# Altium project PCB_Project.PrjPcb
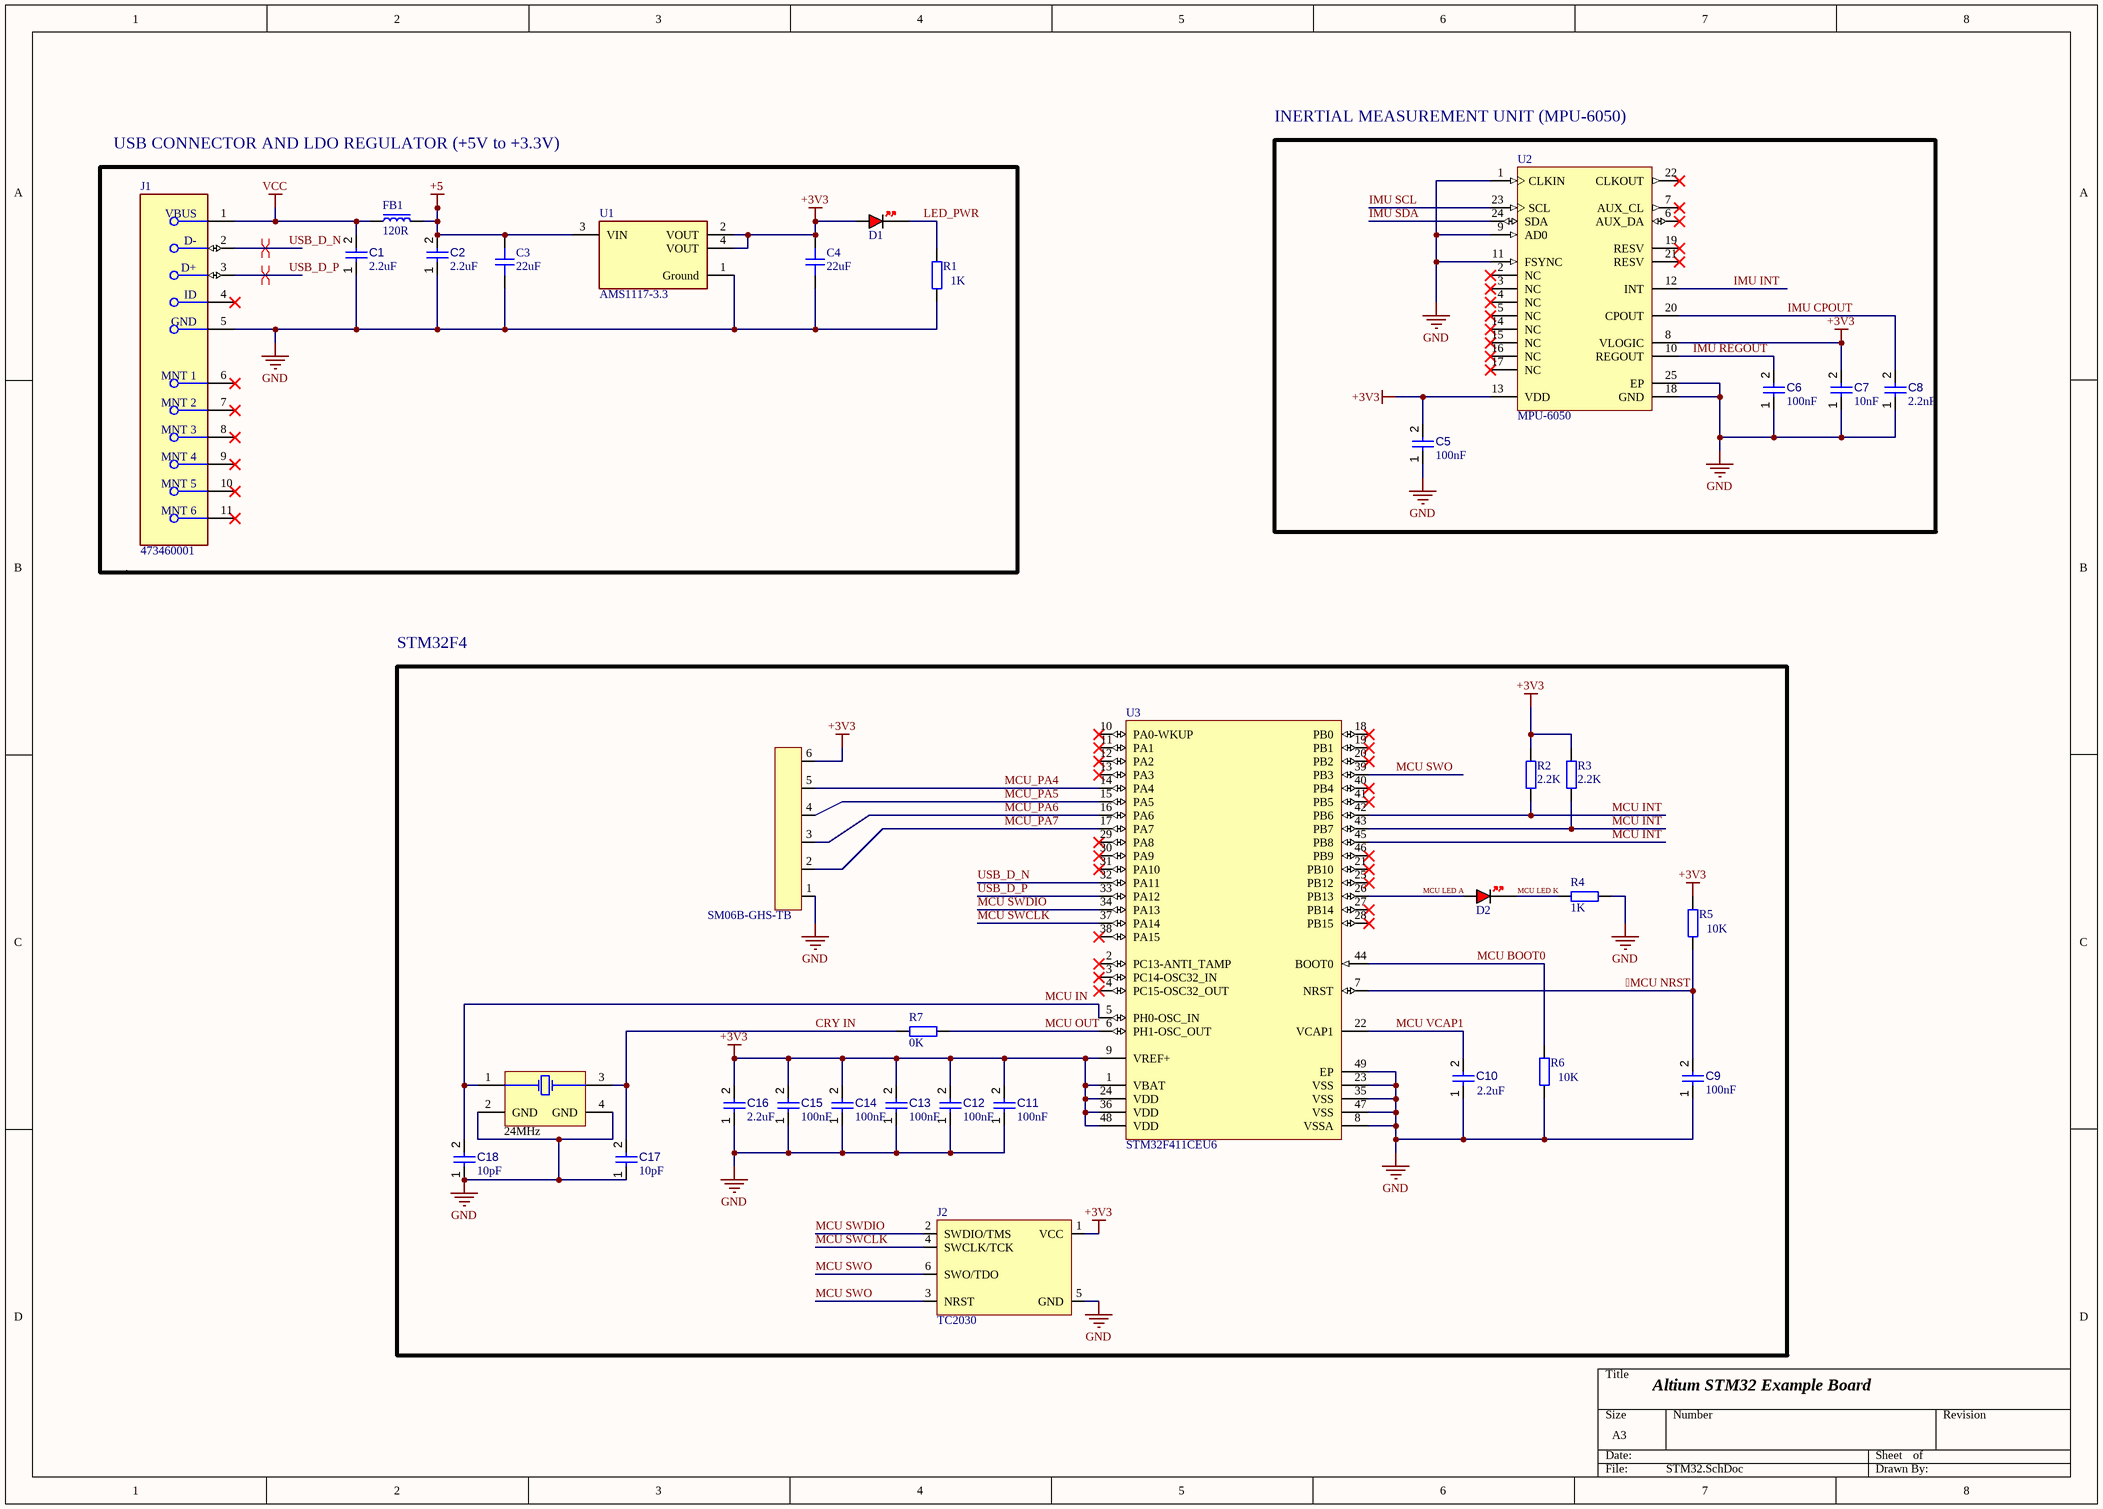
[diagram p0: STM32.SchDoc]
1 sheet, 35 parts. Net scope: global (net labels, ports and power ports of the same name join across sheets).
Board file: STM32.PcbDoc

## Sheet STM32.SchDoc
size A3; SheetNumber: 1; SheetTotal: 1

### Parts
C1  value 2.2uF  [CAPC0402(1005)60_L]  (hidden comment: Capacitor 100nF +/-20% 50V 0402)
C2  value 2.2uF  [CAPC0402(1005)60_L]  (hidden comment: Capacitor 100nF +/-20% 50V 0402)
C3  22uF  [CAP_0805]
C4  22uF  [CAP_0805]
C5  value 100nF  [CAPC0402(1005)60_L]  (hidden comment: Capacitor 100nF +/-20% 50V 0402)
C6  value 100nF  [CAPC0402(1005)60_L]  (hidden comment: Capacitor 100nF +/-20% 50V 0402)
C7  value 10nF  [CAPC0402(1005)60_L]  (hidden comment: Capacitor 100nF +/-20% 50V 0402)
C8  value 2.2nF  [CAPC0402(1005)60_L]  (hidden comment: Capacitor 100nF +/-20% 50V 0402)
C9  value 100nF  [CAPC0402(1005)60_L]  (hidden comment: Capacitor 100nF +/-20% 50V 0402)
C10  value 2.2uF  [CAPC0402(1005)60_L]  (hidden comment: Capacitor 100nF +/-20% 50V 0402)
C11  value 100nF  [CAPC0402(1005)60_L]  (hidden comment: Capacitor 100nF +/-20% 50V 0402)
C12  value 100nF  [CAPC0402(1005)60_L]  (hidden comment: Capacitor 100nF +/-20% 50V 0402)
C13  value 100nF  [CAPC0402(1005)60_L]  (hidden comment: Capacitor 100nF +/-20% 50V 0402)
C14  value 100nF  [CAPC0402(1005)60_L]  (hidden comment: Capacitor 100nF +/-20% 50V 0402)
C15  value 100nF  [CAPC0402(1005)60_L]  (hidden comment: Capacitor 100nF +/-20% 50V 0402)
C16  value 2.2uF  [CAPC0402(1005)60_L]  (hidden comment: Capacitor 100nF +/-20% 50V 0402)
C17  value 10pF  [CAPC0402(1005)60_L]  (hidden comment: Capacitor 100nF +/-20% 50V 0402)
C18  value 10pF  [CAPC0402(1005)60_L]  (hidden comment: Capacitor 100nF +/-20% 50V 0402)
D1  RED  [LED_0402_RED]  (value not drawn)
D2  RED  [LED_0402_RED]  (value not drawn)
FB1  120R  [FB_0402]
J1  473460001  [FP-473460001-MFG]
J2  TC2030  [TC2030-FP]  (no BOM)
R1  1K  [RES_0201]
R2  2.2K  [RES_0201]
R3  2.2K  [RES_0201]
R4  1K  [RES_0201]
R5  10K  [RES_0201]
R6  10K  [RES_0201]
R7  0K  [RES_0201]
U1  AMS1117-3.3  [FP-AMS1117-IPC_C]
U2  MPU-6050  [IS-QFN-24_V]
U3  STM32F411CEU6  [STM-UFQFPN48_L]
  24MHz  [ABRA-ABM3B-4_V]
  SM06B-GHS-TB  [SM06B-GHS-TB]

### Blocks framed on the sheet
USB CONNECTOR AND LDO REGULATOR (+5V to +3.3V): C1-C4 D1 FB1 J1 R1 U1
INERTIAL MEASUREMENT UNIT (MPU-6050): C5-C8 U2
STM32F4: C9-C18 D2 J2 R2-R7 U3 

### Nets
+3V3: C4.2 C5.2 C7.2 C11.2 C12.2 C13.2 C14.2 C15.2 C16.2 D1.A J2.1(VCC) R2.1 R3.1 R5.1 U1.2(VOUT) U1.4(VOUT) U2.8(VLOGIC) U2.13(VDD) U3.1(VBAT) U3.9(VREF+) U3.24(VDD) U3.36(VDD) U3.48(VDD) .6
+5: C2.2 C3.2 FB1.2 U1.3(VIN)
GND: C1.1 C2.1 C3.1 C4.1 C5.1 C6.1 C7.1 C8.1 C9.1 C10.1 C11.1 C12.1 C13.1 C14.1 C15.1 C16.1 C17.1 C18.1 J1.5(GND) J2.5(GND) R1.1 R4.1 R6.2 U1.1(Ground) U2.1(CLKIN) U2.9(AD0) U2.11(FSYNC) U2.18(GND) U2.25(EP) U3.8(VSSA) U3.23(VSS) U3.35(VSS) U3.47(VSS) U3.49(EP) .1 .2(GND) .4(GND)
VCC: C1.2 FB1.1 J1.1(VBUS)
MCU NRST: C9.2 R5.2 U3.7(NRST)
CRY IN: C17.2 R7.1 .3(X2)
IMU CPOUT: C8.2 U2.20(CPOUT)
IMU INT: U2.12(INT)
IMU REGOUT: C6.2 U2.10(REGOUT)
IMU SCL: U2.23(SCL)
IMU SDA: U2.24(SDA)
LED_PWR: D1.K R1.2
MCU BOOT0: R6.1 U3.44(BOOT0)
MCU IN: C18.2 U3.5(PH0-OSC_IN) .1(X1)
MCU INT: R2.2 R3.2 U3.42(PB6) U3.43(PB7) U3.45(PB8)
MCU LED A: D2.A U3.26(PB13)
MCU LED K: D2.K R4.2
MCU OUT: R7.2 U3.6(PH1-OSC_OUT)
MCU SWCLK: J2.4(SWCLK/TCK) U3.37(PA14)
MCU SWDIO: J2.2(SWDIO/TMS) U3.34(PA13)
MCU SWO: J2.3(NRST) J2.6(SWO/TDO) U3.39(PB3)
MCU VCAP1: C10.2 U3.22(VCAP1)
MCU_PA4: U3.14(PA4) .5
MCU_PA5: U3.15(PA5) .4
MCU_PA6: U3.16(PA6) .3
MCU_PA7: U3.17(PA7) .2
USB_D_N: J1.2(D-) U3.32(PA11)
USB_D_P: J1.3(D+) U3.33(PA12)

Not connected (* = marked no-connect by the designer): J1 4(ID)* 6(MNT_1)* 7(MNT_2)* 8(MNT_3)* 9(MNT_4)* 10(MNT_5)* 11(MNT_6)*; U2 2(NC)* 3(NC)* 4(NC)* 5(NC)* 6(AUX_DA)* 7(AUX_CL)* 14(NC)* 15(NC)* 16(NC)* 17(NC)* 19(RESV)* 21(RESV)* 22(CLKOUT)*; U3 2(PC13-ANTI_TAMP)* 3(PC14-OSC32_IN)* 4(PC15-OSC32_OUT)* 10(PA0-WKUP)* 11(PA1)* 12(PA2)* 13(PA3)* 18(PB0)* 19(PB1)* 20(PB2)* 21(PB10)* 25(PB12)* 27(PB14)* 28(PB15)* 29(PA8)* 30(PA9)* 31(PA10)* 38(PA15)* 40(PB4)* 41(PB5)* 46(PB9)*

### Layout directives
differential pair: USB_D_N, USB_D_P

### Notes on the sheet
- Altium STM32 Example Board

### Library data of the parts
C1 C2 C5-C18 = CMP-001-00067-3: Chip Capacitor, 100nF +/-20%, 50V, 0402, Thickness 0.6 mm; Tolerance: 10%; Min Operating Temperature: -55°C; Pins: 2; Case/Package: 0402; Max Operating Temperature: 85°C; Voltage Rating: 50V; Mounting Technology: SMT
C3 C4 = CAP_0805: Capacitor SMD 0805; Manufacturer: *; Manufacturer Part Number: *; Distributor Link: *; LCSC: *; Rating: *; Dielectric: *
D1 D2 = LED_0402_RED: LED 0402 RED SMD
FB1 = FB_0402: Ferrite Bead SMD 0402; Manufacturer: *; Manufacturer Part Number: *; Distributor Link: *; LCSC: *
J1 = CMP-2000-05246-2: CONN RCPT USB2.0 MICRO B SMD R/A; Manufacturer: Molex; Conn Orientation: Right Angle; Is Female: yes; Shielding: true; Pitch: 0.65mm; Number Of Contacts: 5; Voltage Rating: 30V; Current Rating: 1.8A; Device Class L2: USB Connectors; Digikey Description: CONN RCPT USB2.0 MICRO B SMD R/A; Height: 2.945mm; RoHS: TRUE; ComponentLink2Description: Datasheet; Octopart: https://octopart.com/47346-0001-molex-7164928; Automotive: No; Package: 0; Category: Conn; Device Class L1: Connectors; Usb Standard: USB 2.0; Temperature: -30°C to +85°C; Temperature Range Low: -30°C; Footprint Url: https://www.molex.com/pdm_docs/sd/473460001_sd.pdf; ComponentLink2URL: https://www.molex.com/webdocs/datasheets/pdf/en-us/0473460001_IO_CONNECTORS.pdf; Lead Free: Yes; Manufacturer Part Number: 473460001; Contact Material: Gold,Nickel; Temperature Range High: +85°C; Device Class L3: unset
J2 = TC2030: Tag-Connect No-Solder SWD Debug Connector DO NOT PLACE; Manufacturer: Tag-Connect; Manufacturer Part Number: TC2030
R1-R7 = RES_0201: Resistor SMD 0201; Manufacturer: *; Manufacturer Part Number: *; Distributor Link: *; LCSC: *
U1 = CMP-209535-000001-1: LDO Voltage Regulators 1A, 3.3V; Manufacturer: Advanced Monolithic Systems; Dropout Voltage: 1.1V; Output Type: Fixed; Nominal Supply Current: 5mA; Max Power Dissipation: 1.2W; Max Supply Voltage: 15V; Number Of Outputs: 1; Standoff Height: 0.64mm; Max Junction Temp: +125°C; Height: 1.8mm; Package: AMS1117; Device Class L2: Power Management ICs; ComponentLink2Description: Datasheet; ComponentLink2URL: http://www.advanced-monolithic.com/pdf/ds1117.pdf; Category: IC; RoHS: TRUE; Automotive: No; Device Class L1: Integrated Circuits (ICs); Output Current: 1A; Device Class L3: Voltage Regulators - Linear; Temperature: -40°C to +125°C; Output Voltage: 3.3V; Manufacturer Part Number: AMS1117-3.3; Temperature Range Low: -40°C; Octopart: https://octopart.com/ams1117-3.3-advanced+monolithic+systems-25899300; Lead Free: Yes; Ipc Land Pattern Name: SOT229P700X180-4; Temperature Range High: +125°C
U2 = CMP-1753-00002-2: 3-Axis Gyroscope, Accelerometer and a Digital Motion Processor(TM) (DMP), 2.375 to 3.46 V, -40 to 85 degC, 24-Pin QFN, RoHS, Tape and Reel; Manufacturer: InvenSense; Featured Product: MPU-60506-Axis,IntegratedI²CSolution; Other Names: 1428-1007-2 / MPU6050; Sensor Type: MotionTracking; Online Catalog: MPU-6000™Series; Unit PriceUSD: Digital; Datasheet Version: Rev. 3.3, 05/2012; Category: Sensors,Transducers; Datasheet URL: http://datasheet.octopart.com/MPU-6050-InvenSense-datasheet-14421344.pdf; Family: Multifunction; Standard Package: 5,000; Manufacturer URL: http://www.invensense.com/; Output Type: Digital; Dynamic Catalog: MPU-6000™Series
U3 = CMP-0243-00165-1: ARM Cortex-M4 32-bit MCU+FPU, 512 KB Flash, 128 KB RAM, 36 I/Os, 48-Pin UFQFPN, -40 to 85 degC, Tray; Operating Frequency(F) (Processor speed) (MHz): 100; FLASH Size (Prog) (kB): 512; Internal RAM Size (kB): 128; I/Os (High Current): 36; Supply Voltage(Vcc) min (V): 1.7; Package Reference: 48-Pin Ultra Thin Fine Pitch Quad Flat No-Lead, 7 x 7 x 0.6 mm Body, 0.5 mm Pitch, Exposed Pad; ComponentLink1Description: Manufacturer URL; ComponentLink1URL: http://www.st.com/; Packing: Tray; Package Description: UFQFPN48; Core: ARM Cortex-M4; ComponentLink2Description: Datasheet; ComponentLink2URL: http://www.st.com/st-web-ui/static/active/en/resource/technical/document/datasheet/DM00115249.pdf; DatasheetVersion: Rev. 6; Mounting Technology: Surface Mount
 = CMP-003-00016-2: Ceramic SMD Crystal, 12.288 MHz, +/- 20 ppm, 18 pF, -20 to 70 degC, 4-Pin SMD, RoHS, Tape and Reel; Manufacturer: Abracon; Load Capacitance: 18pF; Frequency Tolerance: 20ppm; Resistance: 70Ohm; ESR: 70; Manufacturer URL: http://www.abracon.com/; Datasheet URL: http://www.abracon.com/Resonators/abm3b.pdf; Frequency: 12.288MHz; Min Operating Temperature: -20°C; RoHS Compliant: True; Case/Package: CSMD; Packaging: TapeandReel; Package Reference: ABM3B; Package Description: 4-Pin Surface Mount Device, Body 5 x 3.2 mm; Tolerance: 20ppm; Max Operating Temperature: 70°C; Datasheet Version: Aug-15; Mounting Technology: SM; Package Quantity: 1000; Pins: 4
 = SM06B-GHS-TB: Header Connector 6 Position 1.25MM Pitch SMD Horizontal JST GH; Manufacturer: JST; Manufacturer Part Number: SM06B-GHS-TB